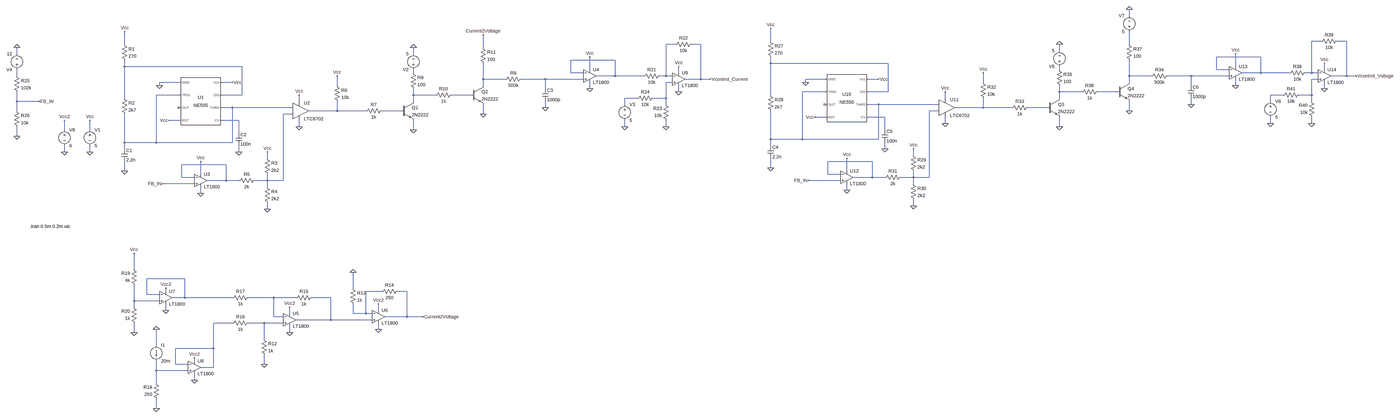
[diagram p0: schematic Current_Control.asc, whole sheet]
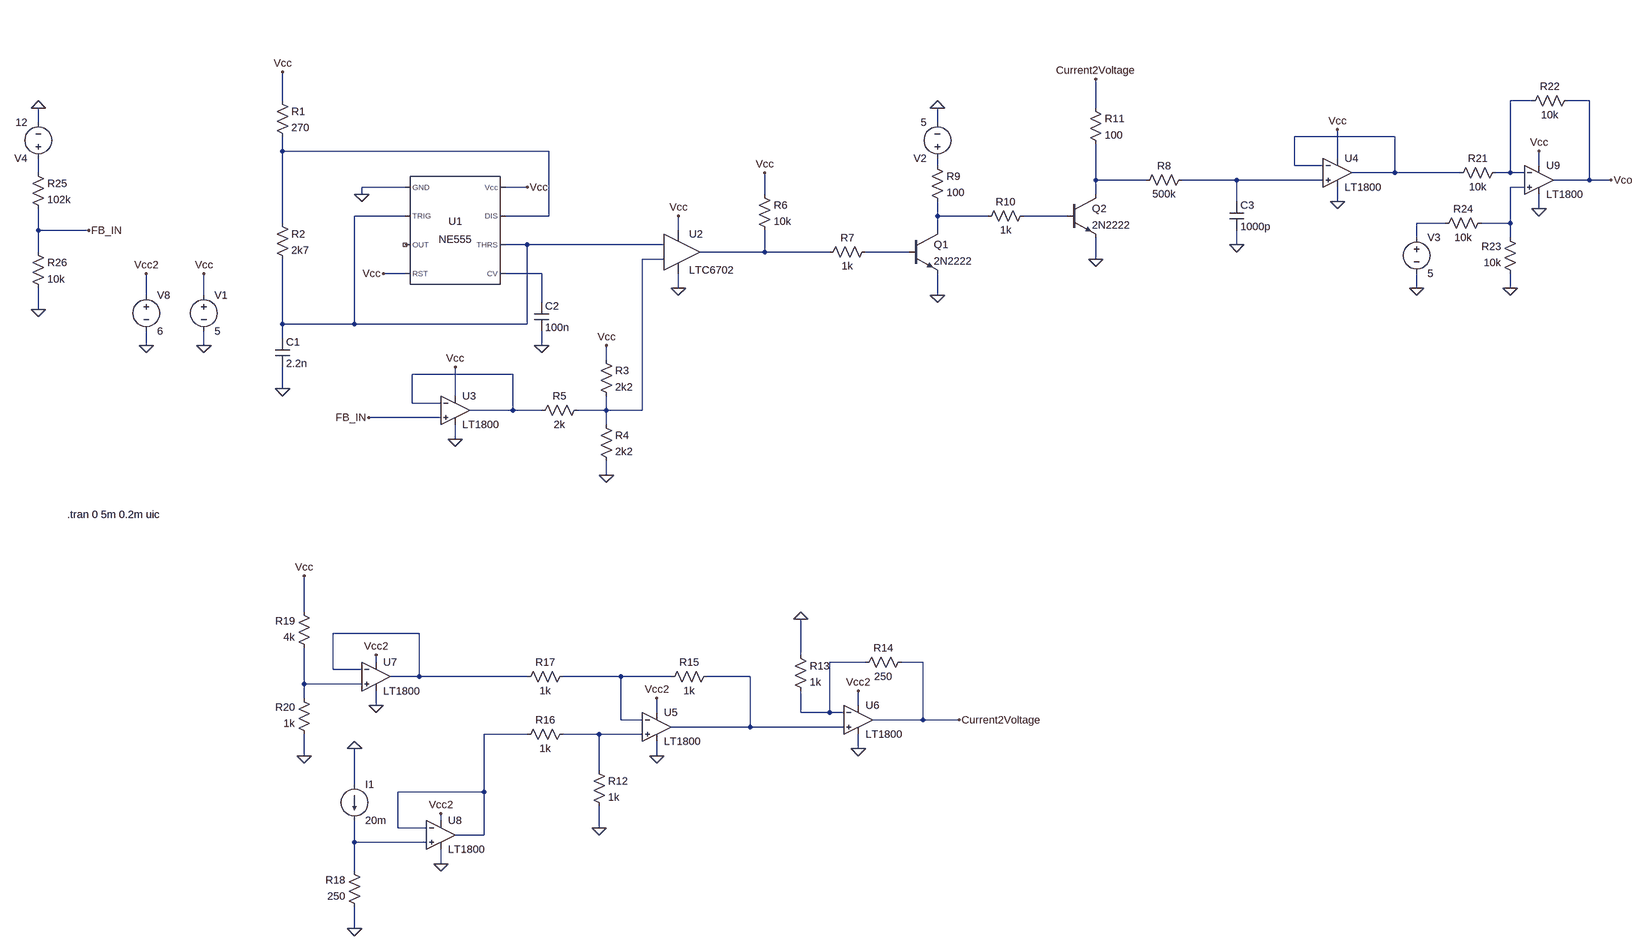
[diagram p1: schematic Current_Control.asc, part, row 1 of 1, column 1 of 2]
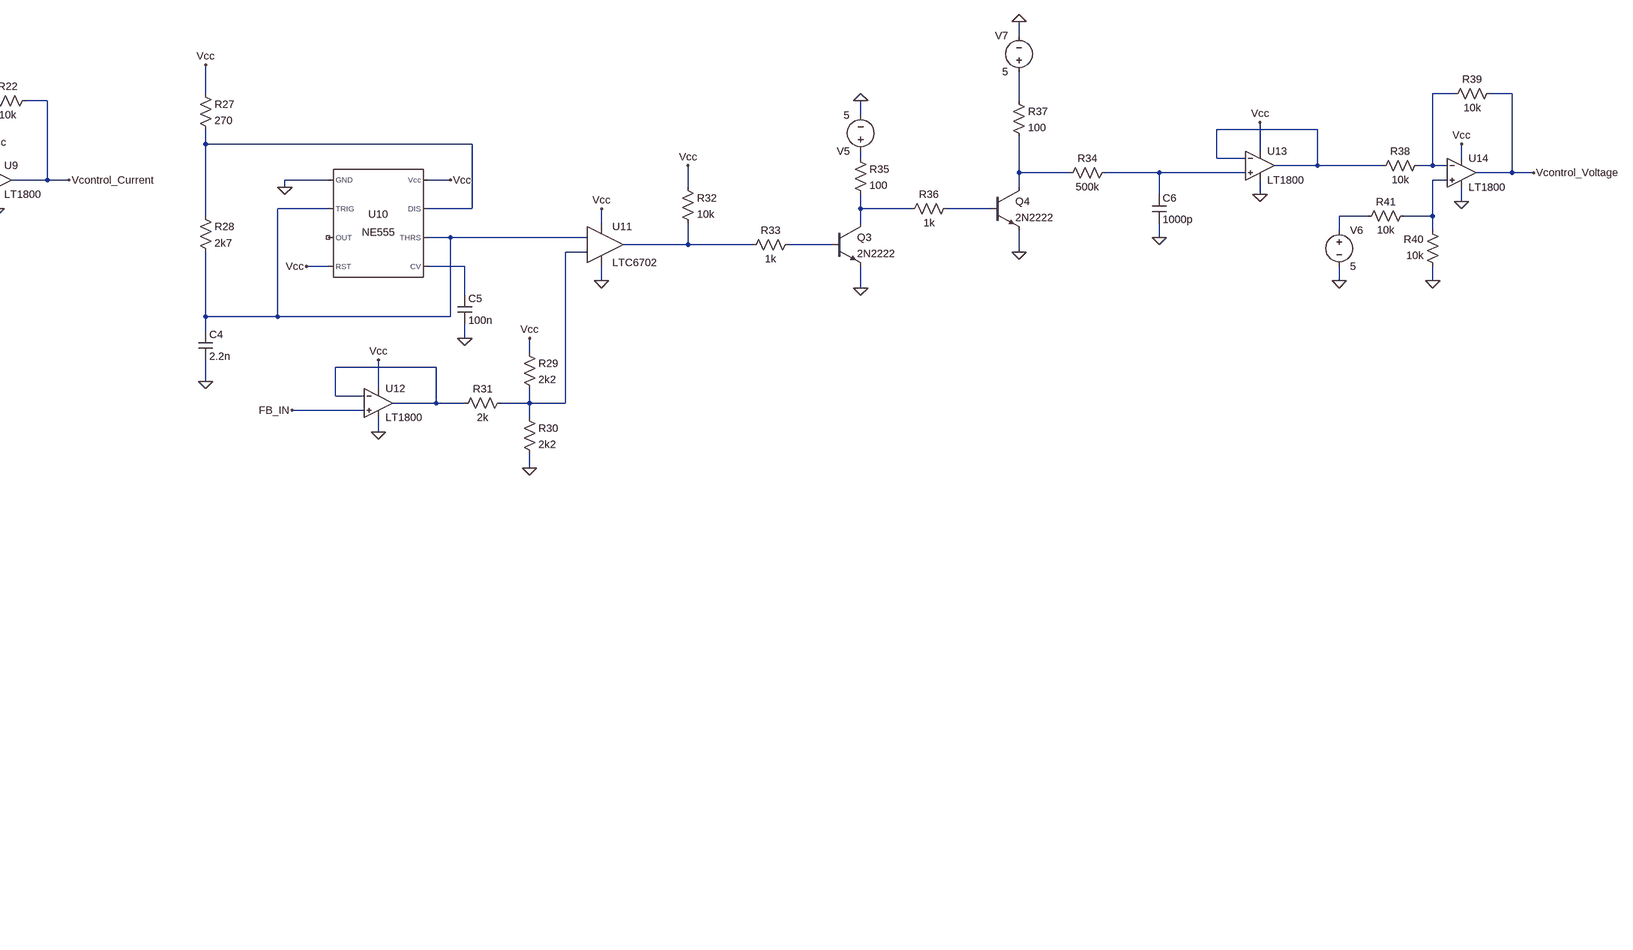
[diagram p2: schematic Current_Control.asc, part, row 1 of 1, column 2 of 2]
Current_Control.asc, the LTspice schematic file:
Version 4
SHEET 1 5272 1124
WIRE 3904 -880 3904 -912
WIRE 2096 -752 2096 -816
WIRE 4880 -752 4832 -752
WIRE 5008 -752 4960 -752
WIRE -1168 -736 -1168 -800
WIRE 1616 -736 1568 -736
WIRE 1744 -736 1696 -736
WIRE 3904 -736 3904 -800
WIRE 640 -720 640 -784
WIRE 3552 -704 3552 -736
WIRE -1856 -688 -1856 -720
WIRE 288 -688 288 -720
WIRE 4576 -672 4352 -672
WIRE 1312 -656 1088 -656
WIRE 2096 -640 2096 -672
WIRE 2688 -640 2096 -640
WIRE -1168 -624 -1168 -656
WIRE -576 -624 -1168 -624
WIRE 4448 -624 4448 -688
WIRE 1184 -608 1184 -672
WIRE 3552 -608 3552 -624
WIRE 4352 -608 4352 -672
WIRE 4416 -608 4352 -608
WIRE 4896 -608 4896 -640
WIRE 288 -592 288 -608
WIRE 1088 -592 1088 -656
WIRE 1152 -592 1088 -592
WIRE 1632 -592 1632 -624
WIRE 4576 -592 4576 -672
WIRE 4576 -592 4480 -592
WIRE 4720 -592 4576 -592
WIRE 4832 -592 4832 -752
WIRE 4832 -592 4800 -592
WIRE 4864 -592 4832 -592
WIRE -1856 -576 -1856 -608
WIRE 1312 -576 1312 -656
WIRE 1312 -576 1216 -576
WIRE 1456 -576 1312 -576
WIRE 1568 -576 1568 -736
WIRE 1568 -576 1536 -576
WIRE 1600 -576 1568 -576
WIRE 3904 -576 3904 -656
WIRE 4016 -576 3904 -576
WIRE 4224 -576 4096 -576
WIRE 4416 -576 4224 -576
WIRE 5008 -576 5008 -752
WIRE 5008 -576 4928 -576
WIRE 5056 -576 5008 -576
WIRE 640 -560 640 -640
WIRE 752 -560 640 -560
WIRE 960 -560 832 -560
WIRE 1152 -560 960 -560
WIRE 1744 -560 1744 -736
WIRE 1744 -560 1664 -560
WIRE 1792 -560 1744 -560
WIRE 2368 -560 2272 -560
WIRE 2640 -560 2592 -560
WIRE 4864 -560 4832 -560
WIRE -896 -544 -992 -544
WIRE -624 -544 -672 -544
WIRE 1600 -544 1568 -544
WIRE 2272 -544 2272 -560
WIRE 3168 -544 3168 -592
WIRE 3904 -544 3904 -576
WIRE -992 -528 -992 -544
WIRE -96 -528 -96 -576
WIRE 640 -528 640 -560
WIRE 4224 -528 4224 -576
WIRE 4448 -528 4448 -560
WIRE 960 -512 960 -560
WIRE 1184 -512 1184 -544
WIRE 4896 -512 4896 -544
WIRE 1632 -496 1632 -528
WIRE 2368 -496 2256 -496
WIRE 2688 -496 2688 -640
WIRE 2688 -496 2592 -496
WIRE 3552 -496 3552 -528
WIRE 3664 -496 3552 -496
WIRE 3840 -496 3744 -496
WIRE -896 -480 -1008 -480
WIRE -576 -480 -576 -624
WIRE -576 -480 -672 -480
WIRE 288 -480 288 -512
WIRE 400 -480 288 -480
WIRE 576 -480 480 -480
WIRE 2096 -480 2096 -640
WIRE 4688 -480 4624 -480
WIRE 4832 -480 4832 -560
WIRE 4832 -480 4768 -480
WIRE -1168 -464 -1168 -624
WIRE 1424 -464 1360 -464
WIRE 1568 -464 1568 -544
WIRE 1568 -464 1504 -464
WIRE 2976 -464 2976 -496
WIRE 3552 -464 3552 -496
WIRE -1856 -448 -1856 -496
WIRE -1744 -448 -1856 -448
WIRE -288 -448 -288 -480
WIRE 288 -448 288 -480
WIRE 4624 -448 4624 -480
WIRE 4832 -448 4832 -480
WIRE 1360 -432 1360 -464
WIRE 1568 -432 1568 -464
WIRE 2640 -432 2592 -432
WIRE 2944 -432 2640 -432
WIRE 4224 -432 4224 -464
WIRE -624 -416 -672 -416
WIRE -320 -416 -624 -416
WIRE 960 -416 960 -448
WIRE 3168 -416 3168 -464
WIRE 3168 -416 3024 -416
WIRE 3312 -416 3168 -416
WIRE 3488 -416 3392 -416
WIRE -1856 -400 -1856 -448
WIRE -96 -400 -96 -448
WIRE -96 -400 -240 -400
WIRE 48 -400 -96 -400
WIRE 224 -400 128 -400
WIRE 2944 -400 2896 -400
WIRE 3904 -400 3904 -448
WIRE -320 -384 -368 -384
WIRE 640 -384 640 -432
WIRE 2368 -368 2320 -368
WIRE 2672 -368 2592 -368
WIRE -896 -352 -944 -352
WIRE -592 -352 -672 -352
WIRE 2976 -336 2976 -368
WIRE 4624 -336 4624 -368
WIRE 4832 -336 4832 -368
WIRE -288 -320 -288 -352
WIRE 1360 -320 1360 -352
WIRE 1568 -320 1568 -352
WIRE 3552 -320 3552 -368
WIRE -1616 -304 -1616 -352
WIRE -1488 -304 -1488 -352
WIRE 288 -304 288 -352
WIRE 2672 -304 2672 -368
WIRE -592 -288 -592 -352
WIRE -1856 -272 -1856 -320
WIRE 2096 -256 2096 -400
WIRE 2256 -256 2256 -496
WIRE 2256 -256 2096 -256
WIRE 2640 -256 2640 -432
WIRE 2640 -256 2256 -256
WIRE -1168 -240 -1168 -384
WIRE -1008 -240 -1008 -480
WIRE -1008 -240 -1168 -240
WIRE -624 -240 -624 -416
WIRE -624 -240 -1008 -240
WIRE 2096 -224 2096 -256
WIRE -1168 -208 -1168 -240
WIRE 2672 -208 2672 -240
WIRE -1616 -192 -1616 -224
WIRE -1488 -192 -1488 -224
WIRE -592 -192 -592 -224
WIRE 2816 -176 2816 -208
WIRE -448 -160 -448 -192
WIRE 2608 -144 2384 -144
WIRE -656 -128 -880 -128
WIRE 2096 -112 2096 -160
WIRE -1168 -96 -1168 -144
WIRE 2480 -96 2480 -160
WIRE -784 -80 -784 -144
WIRE 2384 -80 2384 -144
WIRE 2448 -80 2384 -80
WIRE -880 -64 -880 -128
WIRE -816 -64 -880 -64
WIRE 2608 -64 2608 -144
WIRE 2608 -64 2512 -64
WIRE 2672 -64 2608 -64
WIRE 2816 -64 2816 -96
WIRE 2816 -64 2752 -64
WIRE 2896 -64 2896 -400
WIRE 2896 -64 2816 -64
WIRE -656 -48 -656 -128
WIRE -656 -48 -752 -48
WIRE -592 -48 -656 -48
WIRE -448 -48 -448 -80
WIRE -448 -48 -512 -48
WIRE -368 -48 -368 -384
WIRE -368 -48 -448 -48
WIRE 2448 -48 2288 -48
WIRE -816 -32 -976 -32
WIRE 2816 -32 2816 -64
WIRE -448 -16 -448 -48
WIRE 2480 0 2480 -32
WIRE -784 16 -784 -16
WIRE 2816 80 2816 48
WIRE -448 96 -448 64
WIRE -1120 400 -1120 320
WIRE -864 448 -1056 448
WIRE -16 496 -16 416
WIRE -960 512 -960 496
WIRE 128 512 48 512
WIRE 256 512 208 512
WIRE -1056 528 -1056 448
WIRE -992 528 -1056 528
WIRE -864 544 -864 448
WIRE -864 544 -928 544
WIRE -624 544 -864 544
WIRE -416 544 -544 544
WIRE -304 544 -416 544
WIRE -128 544 -224 544
WIRE -1120 560 -1120 480
WIRE -992 560 -1120 560
WIRE -1120 592 -1120 560
WIRE -960 608 -960 576
WIRE 112 608 112 576
WIRE -336 624 -336 592
WIRE -16 624 -16 576
WIRE 48 624 48 512
WIRE 48 624 -16 624
WIRE 80 624 48 624
WIRE -416 640 -416 544
WIRE -368 640 -416 640
WIRE 256 640 256 512
WIRE 256 640 144 640
WIRE 336 640 256 640
WIRE -128 656 -128 544
WIRE -128 656 -304 656
WIRE 80 656 -128 656
WIRE -624 672 -720 672
WIRE -464 672 -544 672
WIRE -368 672 -464 672
WIRE 112 704 112 672
WIRE -1120 720 -1120 672
WIRE -336 720 -336 688
WIRE -464 752 -464 672
WIRE -1008 784 -1008 704
WIRE -720 800 -720 672
WIRE -720 800 -912 800
WIRE -816 864 -816 848
WIRE -912 880 -912 800
WIRE -848 880 -912 880
WIRE -464 880 -464 832
WIRE -720 896 -720 800
WIRE -720 896 -784 896
WIRE -1008 912 -1008 864
WIRE -848 912 -1008 912
WIRE -816 960 -816 928
WIRE -1008 976 -1008 912
WIRE -1008 1104 -1008 1056
FLAG -1168 -96 0
FLAG -992 -528 0
FLAG -592 -192 0
FLAG -1168 -800 Vcc
FLAG -624 -544 Vcc
FLAG -944 -352 Vcc
FLAG -288 -320 0
FLAG -288 -480 Vcc
FLAG -96 -576 Vcc
FLAG -448 96 0
FLAG -448 -192 Vcc
FLAG -1488 -192 0
FLAG -1488 -352 Vcc
FLAG 288 -720 0
FLAG 288 -304 0
FLAG 960 -416 0
FLAG 1184 -512 0
FLAG 1184 -672 Vcc
FLAG -976 -32 FB_IN
FLAG -784 16 0
FLAG -784 -144 Vcc
FLAG 640 -384 0
FLAG -1120 720 0
FLAG -1008 1104 0
FLAG -464 880 0
FLAG -336 720 0
FLAG 112 704 0
FLAG -16 416 0
FLAG -336 592 Vcc2
FLAG 112 576 Vcc2
FLAG -1008 704 0
FLAG -960 608 0
FLAG -960 496 Vcc2
FLAG -816 960 0
FLAG -816 848 Vcc2
FLAG -1120 320 Vcc
FLAG 640 -784 Current2Voltage
FLAG 1360 -320 0
FLAG 1568 -320 0
FLAG 1632 -496 0
FLAG 1632 -624 Vcc
FLAG 1792 -560 Vcontrol_Current
FLAG -1856 -720 0
FLAG -1856 -272 0
FLAG -1744 -448 FB_IN
FLAG 2096 -112 0
FLAG 2272 -544 0
FLAG 2672 -208 0
FLAG 2096 -816 Vcc
FLAG 2640 -560 Vcc
FLAG 2320 -368 Vcc
FLAG 2976 -336 0
FLAG 2976 -496 Vcc
FLAG 3168 -592 Vcc
FLAG 2816 80 0
FLAG 2816 -208 Vcc
FLAG 3552 -736 0
FLAG 3552 -320 0
FLAG 4224 -432 0
FLAG 4448 -528 0
FLAG 4448 -688 Vcc
FLAG 2288 -48 FB_IN
FLAG 2480 0 0
FLAG 2480 -160 Vcc
FLAG 3904 -400 0
FLAG 4624 -336 0
FLAG 4832 -336 0
FLAG 4896 -512 0
FLAG 4896 -640 Vcc
FLAG 5056 -576 Vcontrol_Voltage
FLAG 3904 -912 0
FLAG -1616 -192 0
FLAG -1616 -352 Vcc2
FLAG 336 640 Current2Voltage
SYMBOL Misc\\NE555 -784 -448 R0
SYMATTR InstName U1
SYMBOL res -1184 -752 R0
SYMATTR InstName R1
SYMATTR Value 270
SYMBOL res -1184 -480 R0
SYMATTR InstName R2
SYMATTR Value 2k7
SYMBOL cap -1184 -208 R0
SYMATTR InstName C1
SYMATTR Value 2.2n
SYMBOL cap -608 -288 R0
SYMATTR InstName C2
SYMATTR Value 100n
SYMBOL res -464 -176 R0
SYMATTR InstName R3
SYMATTR Value 2k2
SYMBOL res -464 -32 R0
SYMATTR InstName R4
SYMATTR Value 2k2
SYMBOL res -496 -64 R90
WINDOW 0 0 56 VBottom 2
WINDOW 3 32 56 VTop 2
SYMATTR InstName R5
SYMATTR Value 2k
SYMBOL res -112 -544 R0
SYMATTR InstName R6
SYMATTR Value 10k
SYMBOL voltage -1488 -320 R0
WINDOW 123 0 0 Left 0
WINDOW 39 0 0 Left 0
SYMATTR InstName V1
SYMATTR Value 5
SYMBOL Comparators\\LTC6702 -288 -400 R0
SYMATTR InstName U2
SYMBOL npn 224 -448 R0
SYMATTR InstName Q1
SYMATTR Value 2N2222
SYMBOL res 144 -416 R90
WINDOW 0 0 56 VBottom 2
WINDOW 3 32 56 VTop 2
SYMATTR InstName R7
SYMATTR Value 1k
SYMBOL voltage 288 -592 R180
WINDOW 123 0 0 Left 0
WINDOW 39 0 0 Left 0
SYMATTR InstName V2
SYMATTR Value 5
SYMBOL cap 944 -512 R0
SYMATTR InstName C3
SYMATTR Value 1000p
SYMBOL res 848 -576 R90
WINDOW 0 0 56 VBottom 2
WINDOW 3 32 56 VTop 2
SYMATTR InstName R8
SYMATTR Value 500k
SYMBOL res 272 -608 R0
SYMATTR InstName R9
SYMATTR Value 100
SYMBOL OpAmps\\LT1800 -784 -112 R0
SYMATTR InstName U3
SYMBOL OpAmps\\LT1800 1184 -640 R0
SYMATTR InstName U4
SYMBOL npn 576 -528 R0
SYMATTR InstName Q2
SYMATTR Value 2N2222
SYMBOL res 496 -496 R90
WINDOW 0 0 56 VBottom 2
WINDOW 3 32 56 VTop 2
SYMATTR InstName R10
SYMATTR Value 1k
SYMBOL res 624 -736 R0
SYMATTR InstName R11
SYMATTR Value 100
SYMBOL OpAmps\\LT1800 -336 592 R0
SYMATTR InstName U5
SYMBOL OpAmps\\LT1800 112 576 R0
SYMATTR InstName U6
SYMBOL res -480 736 R0
SYMATTR InstName R12
SYMATTR Value 1k
SYMBOL res -32 480 R0
SYMATTR InstName R13
SYMATTR Value 1k
SYMBOL res 224 496 R90
WINDOW 0 0 56 VBottom 2
WINDOW 3 32 56 VTop 2
SYMATTR InstName R14
SYMATTR Value 250
SYMBOL res -208 528 R90
WINDOW 0 0 56 VBottom 2
WINDOW 3 32 56 VTop 2
SYMATTR InstName R15
SYMATTR Value 1k
SYMBOL res -528 656 R90
WINDOW 0 0 56 VBottom 2
WINDOW 3 32 56 VTop 2
SYMATTR InstName R16
SYMATTR Value 1k
SYMBOL res -528 528 R90
WINDOW 0 0 56 VBottom 2
WINDOW 3 32 56 VTop 2
SYMATTR InstName R17
SYMATTR Value 1k
SYMBOL res -992 1072 R180
WINDOW 0 36 76 Left 2
WINDOW 3 36 40 Left 2
SYMATTR InstName R18
SYMATTR Value 250
SYMBOL res -1104 496 R180
WINDOW 0 36 76 Left 2
WINDOW 3 36 40 Left 2
SYMATTR InstName R19
SYMATTR Value 4k
SYMBOL res -1104 688 R180
WINDOW 0 36 76 Left 2
WINDOW 3 36 40 Left 2
SYMATTR InstName R20
SYMATTR Value 1k
SYMBOL current -1008 784 R0
WINDOW 123 0 0 Left 0
WINDOW 39 0 0 Left 0
SYMATTR InstName I1
SYMATTR Value 20m
SYMBOL OpAmps\\LT1800 -960 480 R0
SYMATTR InstName U7
SYMBOL OpAmps\\LT1800 -816 832 R0
SYMATTR InstName U8
SYMBOL res 1552 -592 R90
WINDOW 0 0 56 VBottom 2
WINDOW 3 32 56 VTop 2
SYMATTR InstName R21
SYMATTR Value 10k
SYMBOL res 1712 -752 R90
WINDOW 0 0 56 VBottom 2
WINDOW 3 32 56 VTop 2
SYMATTR InstName R22
SYMATTR Value 10k
SYMBOL res 1584 -336 R180
WINDOW 0 36 76 Left 2
WINDOW 3 36 40 Left 2
SYMATTR InstName R23
SYMATTR Value 10k
SYMBOL voltage 1360 -448 R0
WINDOW 123 0 0 Left 0
WINDOW 39 0 0 Left 0
SYMATTR InstName V3
SYMATTR Value 5
SYMBOL res 1520 -480 R90
WINDOW 0 0 56 VBottom 2
WINDOW 3 32 56 VTop 2
SYMATTR InstName R24
SYMATTR Value 10k
SYMBOL OpAmps\\LT1800 1632 -624 R0
SYMATTR InstName U9
SYMBOL voltage -1856 -592 R180
WINDOW 123 0 0 Left 0
WINDOW 39 0 0 Left 0
SYMATTR InstName V4
SYMATTR Value 12
SYMBOL res -1872 -592 R0
SYMATTR InstName R25
SYMATTR Value 102k
SYMBOL res -1872 -416 R0
SYMATTR InstName R26
SYMATTR Value 10k
SYMBOL Misc\\NE555 2480 -464 R0
SYMATTR InstName U10
SYMBOL res 2080 -768 R0
SYMATTR InstName R27
SYMATTR Value 270
SYMBOL res 2080 -496 R0
SYMATTR InstName R28
SYMATTR Value 2k7
SYMBOL cap 2080 -224 R0
SYMATTR InstName C4
SYMATTR Value 2.2n
SYMBOL cap 2656 -304 R0
SYMATTR InstName C5
SYMATTR Value 100n
SYMBOL res 2800 -192 R0
SYMATTR InstName R29
SYMATTR Value 2k2
SYMBOL res 2800 -48 R0
SYMATTR InstName R30
SYMATTR Value 2k2
SYMBOL res 2768 -80 R90
WINDOW 0 0 56 VBottom 2
WINDOW 3 32 56 VTop 2
SYMATTR InstName R31
SYMATTR Value 2k
SYMBOL res 3152 -560 R0
SYMATTR InstName R32
SYMATTR Value 10k
SYMBOL Comparators\\LTC6702 2976 -416 R0
SYMATTR InstName U11
SYMBOL npn 3488 -464 R0
SYMATTR InstName Q3
SYMATTR Value 2N2222
SYMBOL res 3408 -432 R90
WINDOW 0 0 56 VBottom 2
WINDOW 3 32 56 VTop 2
SYMATTR InstName R33
SYMATTR Value 1k
SYMBOL voltage 3552 -608 R180
WINDOW 123 0 0 Left 0
WINDOW 39 0 0 Left 0
SYMATTR InstName V5
SYMATTR Value 5
SYMBOL cap 4208 -528 R0
SYMATTR InstName C6
SYMATTR Value 1000p
SYMBOL res 4112 -592 R90
WINDOW 0 0 56 VBottom 2
WINDOW 3 32 56 VTop 2
SYMATTR InstName R34
SYMATTR Value 500k
SYMBOL res 3536 -624 R0
SYMATTR InstName R35
SYMATTR Value 100
SYMBOL OpAmps\\LT1800 2480 -128 R0
SYMATTR InstName U12
SYMBOL OpAmps\\LT1800 4448 -656 R0
SYMATTR InstName U13
SYMBOL npn 3840 -544 R0
SYMATTR InstName Q4
SYMATTR Value 2N2222
SYMBOL res 3760 -512 R90
WINDOW 0 0 56 VBottom 2
WINDOW 3 32 56 VTop 2
SYMATTR InstName R36
SYMATTR Value 1k
SYMBOL res 3888 -752 R0
SYMATTR InstName R37
SYMATTR Value 100
SYMBOL res 4816 -608 R90
WINDOW 0 0 56 VBottom 2
WINDOW 3 32 56 VTop 2
SYMATTR InstName R38
SYMATTR Value 10k
SYMBOL res 4976 -768 R90
WINDOW 0 0 56 VBottom 2
WINDOW 3 32 56 VTop 2
SYMATTR InstName R39
SYMATTR Value 10k
SYMBOL res 4848 -352 R180
WINDOW 0 36 76 Left 2
WINDOW 3 36 40 Left 2
SYMATTR InstName R40
SYMATTR Value 10k
SYMBOL voltage 4624 -464 R0
WINDOW 123 0 0 Left 0
WINDOW 39 0 0 Left 0
SYMATTR InstName V6
SYMATTR Value 5
SYMBOL res 4784 -496 R90
WINDOW 0 0 56 VBottom 2
WINDOW 3 32 56 VTop 2
SYMATTR InstName R41
SYMATTR Value 10k
SYMBOL OpAmps\\LT1800 4896 -640 R0
SYMATTR InstName U14
SYMBOL voltage 3904 -784 R180
WINDOW 0 24 96 Left 2
WINDOW 3 24 16 Left 2
WINDOW 123 0 0 Left 0
WINDOW 39 0 0 Left 0
SYMATTR InstName V7
SYMATTR Value 5
SYMBOL voltage -1616 -320 R0
WINDOW 123 0 0 Left 0
WINDOW 39 0 0 Left 0
SYMATTR InstName V8
SYMATTR Value 6
TEXT -1792 184 Left 2 !.tran 0 5m 0.2m uic

The netlist it stands for:
* Current_Control.asc
XU1 0 N020 NC_01 Vcc N032 N020 N007 Vcc NE555  ; pins GND TRIG OUT RST CV THRS DIS Vcc
R1 Vcc N007 270
R2 N007 N020 2k7
C1 N020 0 2.2n
C2 N032 0 100n
R3 Vcc N030 2k2
R4 N030 0 2k2
R5 N030 N034 2k
R6 Vcc N027 10k
V1 Vcc 0 5
XU2 N030 N020 Vcc 0 N027 LTC6702
Q1 N021 N028 0 0 2N2222
R7 N028 N027 1k
V2 N009 0 5
C3 N014 0 1000p
R8 N014 N013 500k
R9 N009 N021 100
XU3 FB_IN N034 Vcc 0 N034 LT1800  ; pins In+ In- V+ V- OUT
XU4 N014 N005 Vcc 0 N005 LT1800  ; pins In+ In- V+ V- OUT
Q2 N013 N022 0 0 2N2222
R10 N022 N021 1k
R11 Current2Voltage N013 100
XU5 N041 N037 Vcc2 0 N038 LT1800  ; pins In+ In- V+ V- OUT
XU6 N038 N036 Vcc2 0 Current2Voltage LT1800  ; pins In+ In- V+ V- OUT
R12 N041 0 1k
R13 0 N036 1k
R14 Current2Voltage N036 250
R15 N038 N037 1k
R16 N041 N040 1k
R17 N037 N035 1k
R18 0 N042 250
R19 N039 Vcc 4k
R20 0 N039 1k
I1 0 N042 20m
XU7 N039 N035 Vcc2 0 N035 LT1800  ; pins In+ In- V+ V- OUT
XU8 N042 N040 Vcc2 0 N040 LT1800  ; pins In+ In- V+ V- OUT
R21 N002 N005 10k
R22 Vcontrol_Current N002 10k
R23 0 N016 10k
V3 N024 0 5
R24 N016 N024 10k
XU9 N016 N002 Vcc 0 Vcontrol_Current LT1800  ; pins In+ In- V+ V- OUT
V4 N010 0 12
R25 N010 FB_IN 102k
R26 FB_IN 0 10k
XU10 0 N017 NC_02 Vcc N031 N017 N006 Vcc NE555  ; pins GND TRIG OUT RST CV THRS DIS Vcc
R27 Vcc N006 270
R28 N006 N017 2k7
C4 N017 0 2.2n
C5 N031 0 100n
R29 Vcc N029 2k2
R30 N029 0 2k2
R31 N029 N033 2k
R32 Vcc N025 10k
XU11 N029 N017 Vcc 0 N025 LTC6702
Q3 N018 N026 0 0 2N2222
R33 N026 N025 1k
V5 N008 0 5
C6 N012 0 1000p
R34 N012 N011 500k
R35 N008 N018 100
XU12 FB_IN N033 Vcc 0 N033 LT1800  ; pins In+ In- V+ V- OUT
XU13 N012 N004 Vcc 0 N004 LT1800  ; pins In+ In- V+ V- OUT
Q4 N011 N019 0 0 2N2222
R36 N019 N018 1k
R37 N003 N011 100
R38 N001 N004 10k
R39 Vcontrol_Voltage N001 10k
R40 0 N015 10k
V6 N023 0 5
R41 N015 N023 10k
XU14 N015 N001 Vcc 0 Vcontrol_Voltage LT1800  ; pins In+ In- V+ V- OUT
V7 N003 0 5
V8 Vcc2 0 6
.model NPN NPN
.model PNP PNP
.lib standard.bjt
.tran 0 5m 0.2m uic
.lib NE555.sub
.lib LTC3.lib
.backanno
.end